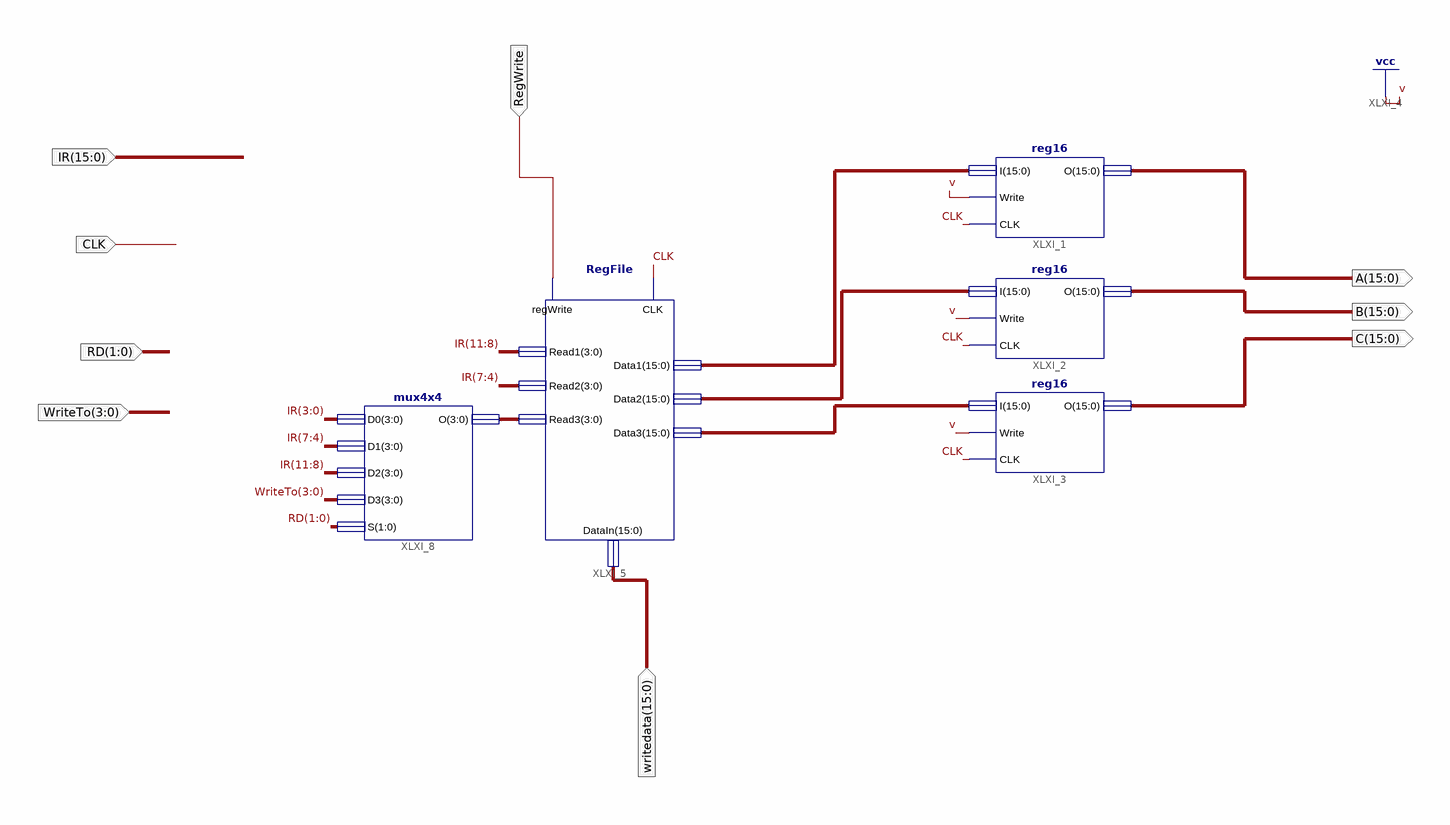
[diagram p0: schematic sheet 1]
// Xilinx ISE schematic RegComp.sch (spartan3e) as structural Verilog: 5 symbols, 9 ports
module RegComp (
  input  [15:0] IR,
  input  RegWrite,
  input  CLK,
  input  [15:0] writedata,
  input  [3:0] WriteTo,
  input  [1:0] RD,
  output [15:0] A,
  output [15:0] B,
  output [15:0] C
);

  wire [3:0] XLXN_14;
  wire [15:0] XLXN_10, XLXN_11, XLXN_12;

  reg16 XLXI_1 (.I(XLXN_10), .Write(1'b1), .CLK(CLK), .O(A));
  reg16 XLXI_2 (.I(XLXN_11), .Write(1'b1), .CLK(CLK), .O(B));
  reg16 XLXI_3 (.I(XLXN_12), .Write(1'b1), .CLK(CLK), .O(C));
  RegFile XLXI_5 (
    .regWrite(RegWrite), .CLK(CLK), .Read1(IR[11:8]), .Read2(IR[7:4]), .Read3(XLXN_14), .DataIn(writedata),
    .Data2(XLXN_11), .Data1(XLXN_10), .Data3(XLXN_12));
  mux4x4 XLXI_8 (.D0(IR[3:0]), .D1(IR[7:4]), .D2(IR[11:8]), .D3(WriteTo), .S(RD), .O(XLXN_14));
endmodule
